# EAGLE design 8_EBUS (EAGLE 7.7.0)
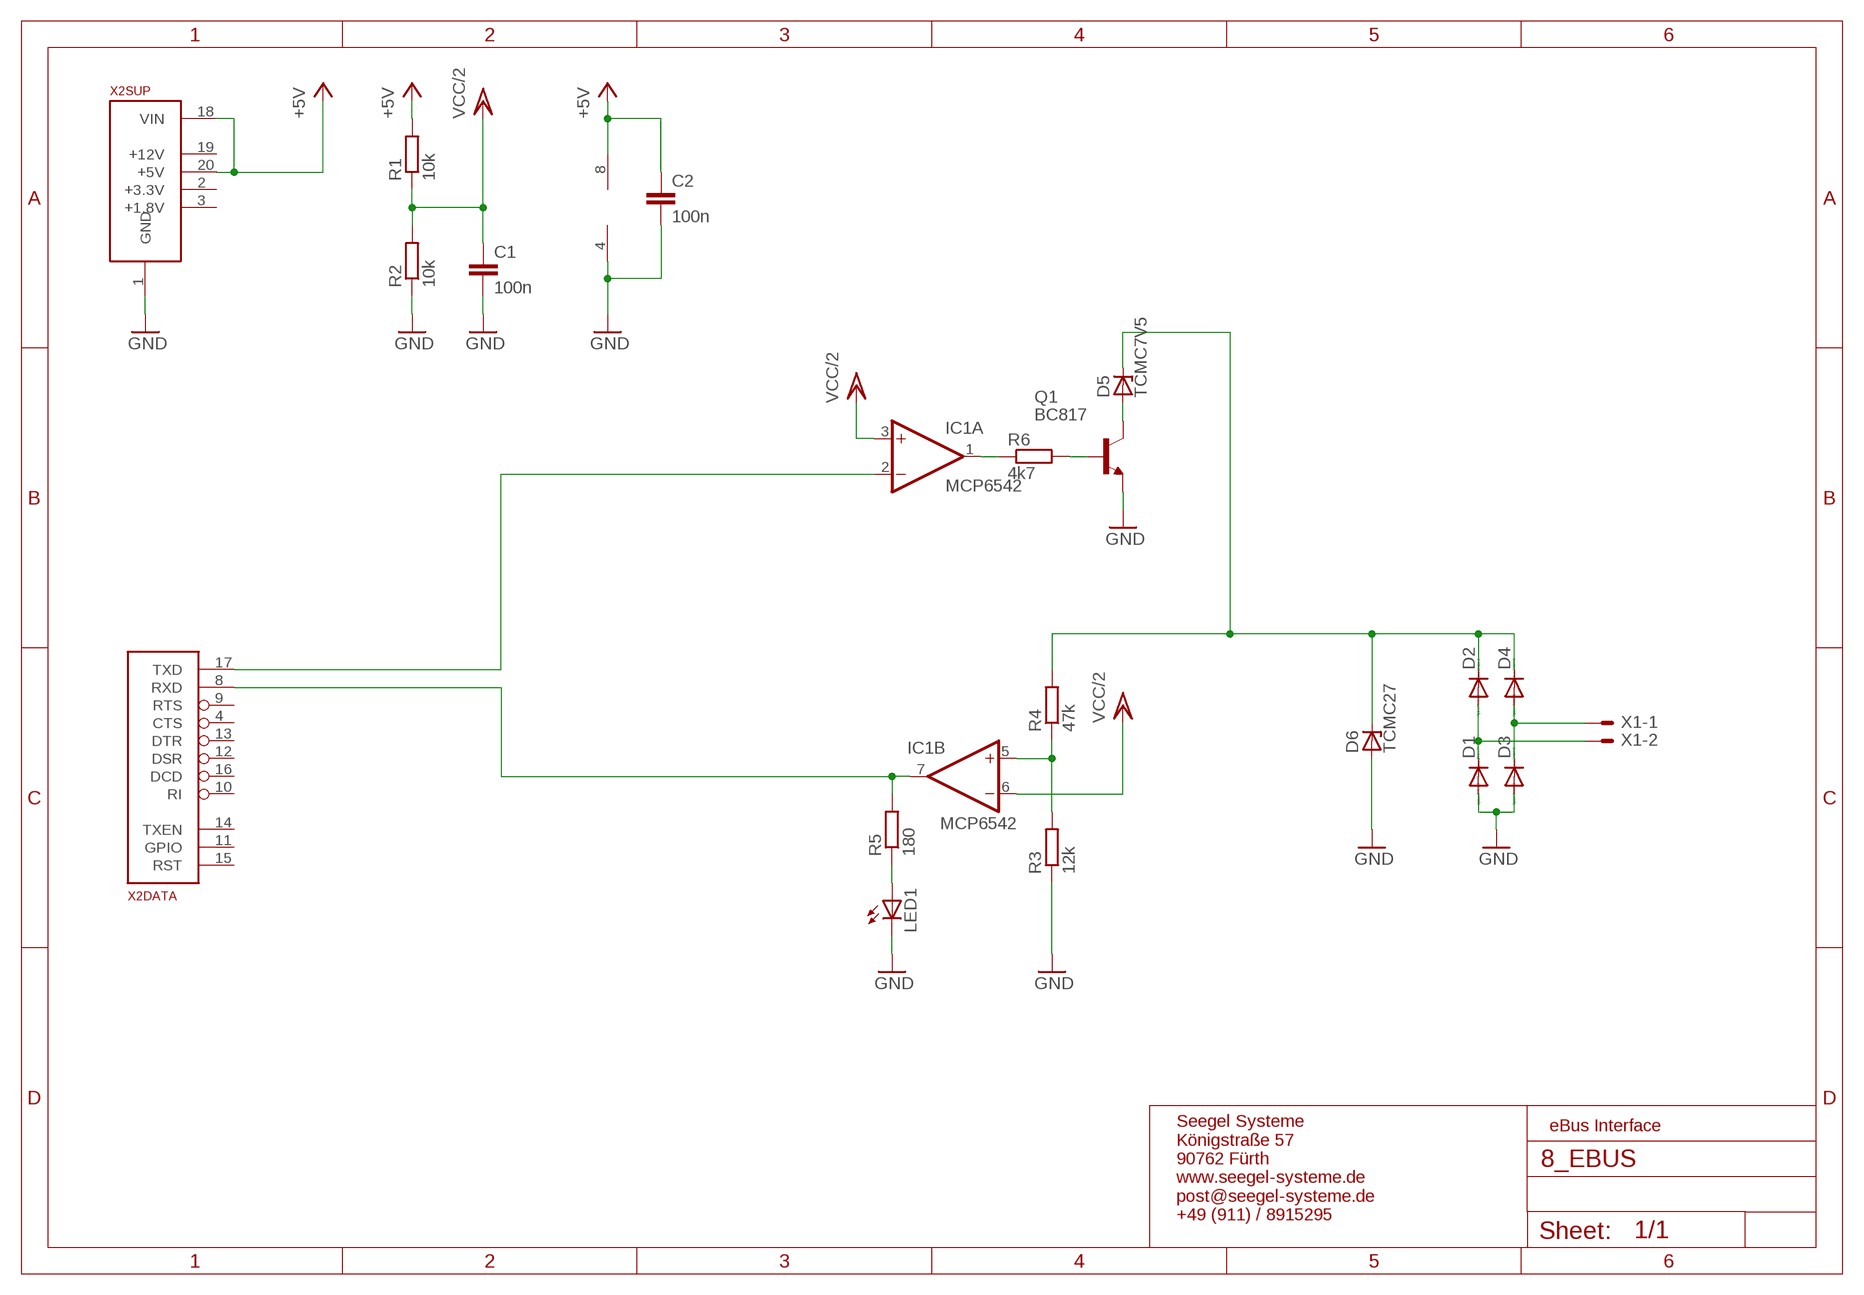
[diagram p0: schematic, sheet 1]

## Parts
C1  100n  C-EUC0805  [C0805]
C2  100n  C-EUC0805  [C0805]
D1  DIODE-SOD80C  [SOD80C]
D2  DIODE-SOD80C  [SOD80C]
D3  DIODE-SOD80C  [SOD80C]
D4  DIODE-SOD80C  [SOD80C]
D5  TCMC7V5  ZENER-DIODESOD80C  [SOD80C]
D6  TCMC27  ZENER-DIODESOD80C  [SOD80C]
IC1  MCP6542  LM393D  [SO08]
LED1  LEDCHIPLED_0805  [CHIPLED_0805]
Q1  BC817  BC817-16LT1SMD  [SOT23-BEC]
R1  10k  R-EU_R0805  [R0805]
R2  10k  R-EU_R0805  [R0805]
R3  12k  R-EU_R0805  [R0805]
R4  47k  R-EU_R0805  [R0805]
R5  180  R-EU_R0805  [R0805]
R6  4k7  R-EU_R0805  [R0805]
X1  AKL18X-02W  [AKL182-02]
X2  ALLSERIALSLAVE  [DAUGHTER-THT]

## Nets
+5V: C2.1 IC1.8(P:V+) R1.2 X2.18(SUP:VIN) X2.20(SUP:+5V)
GND: C1.2 C2.2 D1.A D3.A D6.A IC1.4(P:V-) LED1.C Q1.E R2.1 R3.1 X2.1(SUP:GND)
N$1: D2.C D4.C D5.C D6.C R4.2
N$2: D3.C D4.A X1.P$1
N$3: D1.C D2.A X1.P$2
N$4: Q1.B R6.2
N$5: D5.A Q1.C
N$7: IC1.5(B:+IN) R3.2 R4.1
N$8: IC1.2(A:-IN) X2.17(DATA:TXD)
N$9: IC1.1(A:OUT) R6.1
N$10: LED1.A R5.1
N$11: IC1.7(B:OUT) R5.2 X2.8(DATA:RXD)
VCC/2: C1.1 IC1.3(A:+IN) IC1.6(B:-IN) R1.1 R2.2
Unconnected: X2.2(SUP:+3.3V) X2.3(SUP:+1.8V) X2.4(DATA:CTS) X2.5(USB:D-) X2.6(USB:D+) X2.7(USB:VUSB) X2.9(DATA:RTS) X2.10(DATA:RI) X2.11(DATA:GPIO) X2.12(DATA:DSR) X2.13(DATA:DTR) X2.14(DATA:TXEN) X2.15(DATA:RST) X2.16(DATA:DCD) X2.19(SUP:+12V)

## Notes on the sheet
- eBus Interface
- Seegel Systeme
  Königstraße 57
  90762 Fürth
  www.seegel-systeme.de
  post@seegel-systeme.de
  +49 (911) / 8915295

## Library data of the parts
C1 C2 = rcl:C-EU: CAPACITOR, European symbol
D1-D4 = diode:DIODE-: DIODE
D5 D6 = diode:ZENER-DIODE: Z-Diode
IC1 = linear:LM393: COMPARATOR
LED1 = led:LED: LED OSRAM: - CHIPLED LG R971, LG N971, LY N971, LG Q971, LY Q971, LO R971, LY R971 LH N974, LH R974 LS Q976, LO Q976, LY Q976 LO Q996 - Hyper CHIPLED LW Q18S LB Q993, LB Q99A, LB R99A - SideLED LS A670, LO A670, LY A670, LG A670, LP A670 LB A673, LV A673, LT A673, LW A673 LH A674 LY A675 LS A676, LA A676, LO A676, LY A676, LW A676 LS A679, LY A679, LG A679 - Hyper Micro SIDELED® LS Y876, LA Y876, LO Y876, LY Y876 LT Y87S - SmartLED LW L88C, LW L88S LB L89C, LB L89S, LG L890 LS L89K, LO L89K, LY L89K LS L896, LA L896, LO L896, LY L896 - TOPLED LS T670, LO T670, LY T670, LG T670, LP T670 LSG T670, LSP T670, LSY T670, LOP T670, LYG T670 LG T671, LOG T671, LSG T671 LB T673, LV T673, LT T673, LW T673 LH T674 LS T676, LA T676, LO T676, LY T676, LB T676, LH T676, LSB T676, LW T676 LB T67C, LV T67C, LT T67C, LS T67K, LO T67K, LY T67K, LW E67C LS E67B, LA E67B, LO E67B, LY E67B, LB E67C, LV E67C, LT E67C LW T67C LS T679, LY T679, LG T679 LS T770, LO T770, LY T770, LG T770, LP T770 LB T773, LV T773, LT T773, LW T773 LH T774 LS E675, LA E675, LY E675, LS T675 LS T776, LA T776, LO T776, LY T776, LB T776 LHGB T686 LT T68C, LB T68C - Hyper Mini TOPLED® LB M676 - Mini TOPLED Santana® LG M470 LS M47K, LO M47K, LY M47K Source: http://www.osram.convergy.de LUXEON: - LUMILED® LXK2-PW12-R00, LXK2-PW12-S00, LXK2-PW14-U00, LXK2-PW14-V00 LXK2-PM12-R00, LXK2-PM12-S00, LXK2-PM14-U00 LXK2-PE12-Q00, LXK2-PE12-R00, LXK2-PE12-S00, LXK2-PE14-T00, LXK2-PE14-U00 LXK2-PB12-K00, LXK2-PB12-L00, LXK2-PB12-M00, LXK2-PB14-N00, LXK2-PB14-P00, LXK2-PB14-Q00 LXK2-PR12-L00, LXK2-PR12-M00, LXK2-PR14-Q00, LXK2-PR14-R00 LXK2-PD12-Q00, LXK2-PD12-R00, LXK2-PD12-S00 LXK2-PH12-R00, LXK2-PH12-S00 LXK2-PL12-P00, LXK2-PL12-Q00, LXK2-PL12-R00 Source: www.luxeon.com KINGBRIGHT: KA-3528ASYC Source: www.kingbright.com
Q1 = transistor-npn:BC817*: NPN Transistor
R1-R6 = rcl:R-EU_: RESISTOR, European symbol
X1 = con-riacon_akl:AKL18X-02: Riacon AKL18X Steckverbinder 2-Pol Grid = 3,5mm
X2 = AllSerialv2:ALLSERIALSLAVE

## Board
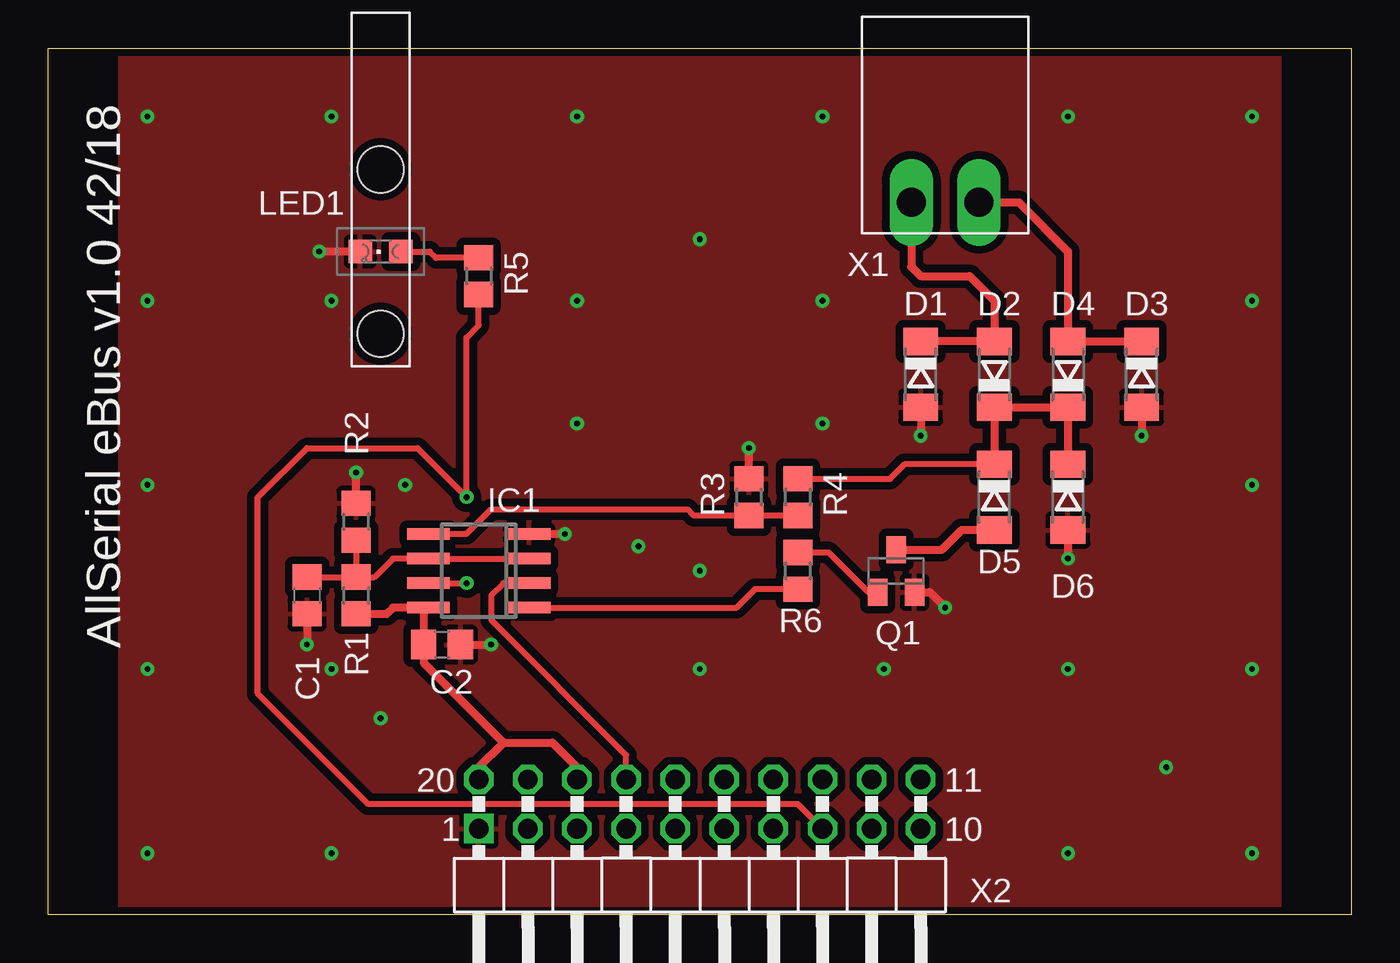
[diagram p1: board, top side]
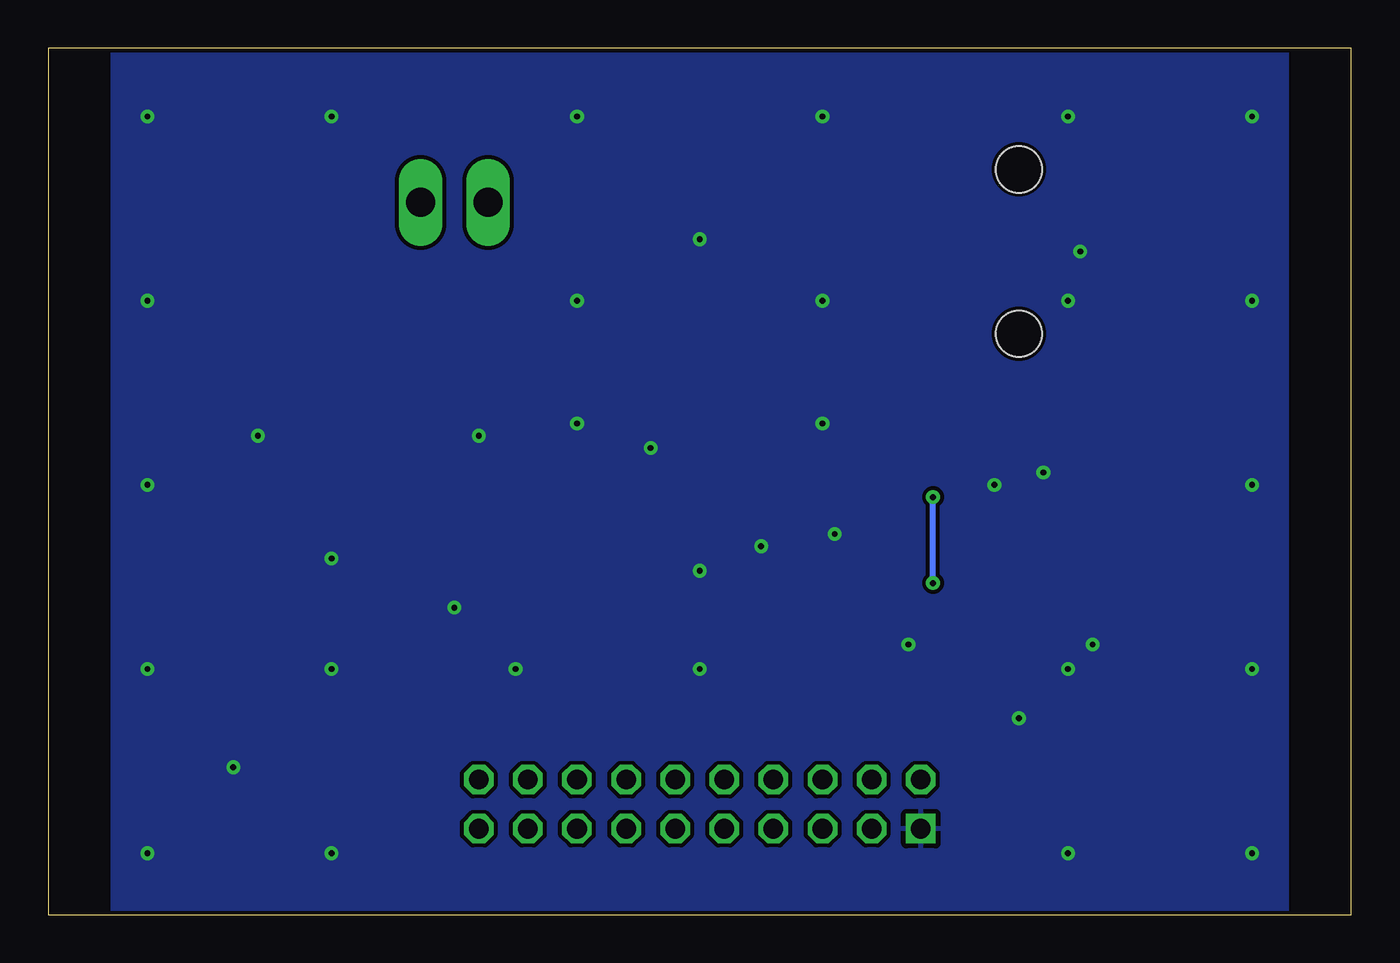
[diagram p2: board, bottom side, seen from below]

Size 67.4 x 44.8 mm. Coordinates in mm from the lower left corner, seen from the top.
Copper layers (1*16): Top 0.035mm / dielectric 1.5mm / Bottom 0.035mm
Design rules "default *": minimum track width 10mil, minimum drill 24mil, track to track 8mil, track to pad 8mil, pad to pad 8mil, via to via 8mil, smd to smd 8mil, copper to edge 0.2mm, drill to drill 8mil, minimum pad ring 10mil, minimum via ring 8mil, stop-mask expansion 4mil, vias tented up to drill 0.3mm, thermal gap 10mil

### Footprints (pad centres in the part's own frame; a part is rotated, then mirrored left to right if it is on the bottom)
C0805 = smd 1.3 x 1.5: 1 -0.95,0; 2 0.95,0
SOD80C = smd 1.4 x 1.8: A 1.7,0; C -1.7,0
SO08 = smd 0.6 x 2.2: 1 -1.905,-2.6; 2 -0.635,-2.6; 3 0.635,-2.6; 4 1.905,-2.6; 5 1.905,2.6; 6 0.635,2.6; 7 -0.635,2.6; 8 -1.905,2.6
CHIPLED_0805 = smd 1.2 x 1.2: A 0,-1.05; C 0,1.05
SOT23-BEC = smd 1 x 1.4: B -0.95,-1.1; C 0,1.1; E 0.95,-1.1
R0805 = smd 1.3 x 1.5: 1 -0.95,0; 2 0.95,0
1271.1000 = hole 2.4: 0,-4.25; 0,4.25
AKL182-02 = drill 1.5 pad 2.184 long: P$1 -1.75,0; P$2 1.75,0
DAUGHTER-THT = drill 1.016 square: 1 -11.43,4.445 | drill 1.016 octagon: 2 -8.89,4.445; 3 -6.35,4.445; 4 -3.81,4.445; 5 -1.27,4.445; 6 1.27,4.445; 7 3.81,4.445; 8 6.35,4.445; 9 8.89,4.445; 10 11.43,4.445; 11 11.43,6.985; 12 8.89,6.985; 13 6.35,6.985; 14 3.81,6.985; 15 1.27,6.985; 16 -1.27,6.985; 17 -3.81,6.985; 18 -6.35,6.985; 19 -8.89,6.985; 20 -11.43,6.985

### Placement (x,y rotation side)
C1  13.38,16.51 270 top
C2  20.37,13.97 0 top
D1  45.13,27.94 270 top
D2  48.94,27.94 90 top
D3  56.56,27.94 270 top
D4  52.75,27.94 90 top
D5  48.94,21.59 270 top
D6  52.75,21.59 270 top
IC1  22.27,17.78 90 top
LED1  17.19,34.29 90 top
Q1  43.86,17.78 0 top
R1  15.92,16.51 270 top
R2  15.92,20.32 270 top
R3  36.24,21.59 270 top
R4  38.78,21.59 90 top
R5  22.27,33.02 270 top
R6  38.78,17.78 90 top
U$1  [1271.1000]  17.19,34.29 0 top
X1  46.4,36.83 180 top
X2  33.7,0 0 top

### Tracks (layer width: path | path; a pad name or v marks a point on that pad's centre or on a via)
+5V
  Top 0.406: R1.2 17.51,15.56 17.83,15.88 IC1.8 19.42,15.62 C2.1 19.42,13.02 23.54,8.89 | X2.18 27.35,7.62 26.08,8.89 23.54,8.89 | X2.20 22.27,7.62 23.54,8.89
GND  (via drill 0.3)
  Top 0.406: C1.2 v13.38,13.97 | C2.2 v22.91,13.97 | IC1.4 v26.72,19.68 | R3.1 v36.24,24.13 | D1.A v45.13,24.77 | D3.A v56.56,24.77 | D6.A v52.75,18.41 | Q1.E 45.59,16.68 v46.4,15.88 | R2.1 v15.92,22.86 | LED1.C v14.02,34.29
  other vias: 5.13,3.17 5.13,12.7 5.13,22.23 5.13,31.75 5.13,41.27 62.28,41.27 62.28,31.75 62.28,22.23 62.28,12.7 62.28,3.17 14.65,41.27 14.65,31.75 14.65,3.17 14.65,12.7 52.75,41.27 52.75,12.7 52.75,3.17 43.23,12.7 33.7,12.7 27.35,41.27 40.05,41.27 27.35,31.75 40.05,31.75 33.7,34.92 27.35,25.4 40.05,25.4 30.53,19.05 17.19,10.16 18.46,22.23 33.7,17.78 57.83,7.62
  pour Bottom: -0.59,44.45 67.99,44.45 67.99,0 -0.59,0
  pour Top (isolate 0.406): 0.68,0 69.26,0 69.26,44.45 0.68,44.45
N$1
  Top 0.305: R4.2 43.54,22.54 44.29,23.29 D5.C
  Top 0.406: D5.C D2.C D4.C D6.C
N$2
  Top 0.406: X1.P$1 50.21,36.83 52.75,34.29 D4.A D3.C
N$3
  Top 0.406: X1.P$2 44.65,33.5 45.13,33.02 47.67,33.02 48.94,31.75 D2.A D1.C
N$4
  Top 0.305: R6.2 40.37,18.73 42.42,16.68 Q1.B
N$5
  Top 0.406: Q1.C 46.23,18.88 47.24,19.89 D5.A
N$7
  Top 0.305: IC1.5 21.64,19.68 22.91,20.95 33.07,20.95 33.38,20.64 R3.2 R4.1
N$8
  Top 0.305: IC1.2 23.54,17.14 22.91,16.51 22.91,15.24 29.89,8.26 X2.17
N$9
  Top 0.305: IC1.1 35.61,15.88 36.56,16.83 R6.1
N$10
  Top 0.305: LED1.A 19.73,34.29 20.05,33.97 R5.1
N$11  (via drill 0.3)
  Top 0.305: IC1.7 v21.64,17.14 | R5.2 22.27,30.48 21.64,29.84 v21.64,21.59 19.1,24.13 13.38,24.13 10.84,21.59 10.84,11.43 16.56,5.71 38.78,5.71 X2.8
  Bottom 0.305: v21.64,17.14 v21.64,21.59
VCC/2
  Top 0.305: R1.1 16.87,17.46 17.83,18.41 IC1.6 IC1.3 | C1.1 R1.1 | R2.2 R1.1

### Text on the board
tPlace: AllSerial eBus v1.0 42/18